# Altium project EFPR-HPTECH_V1.2.PrjPCB
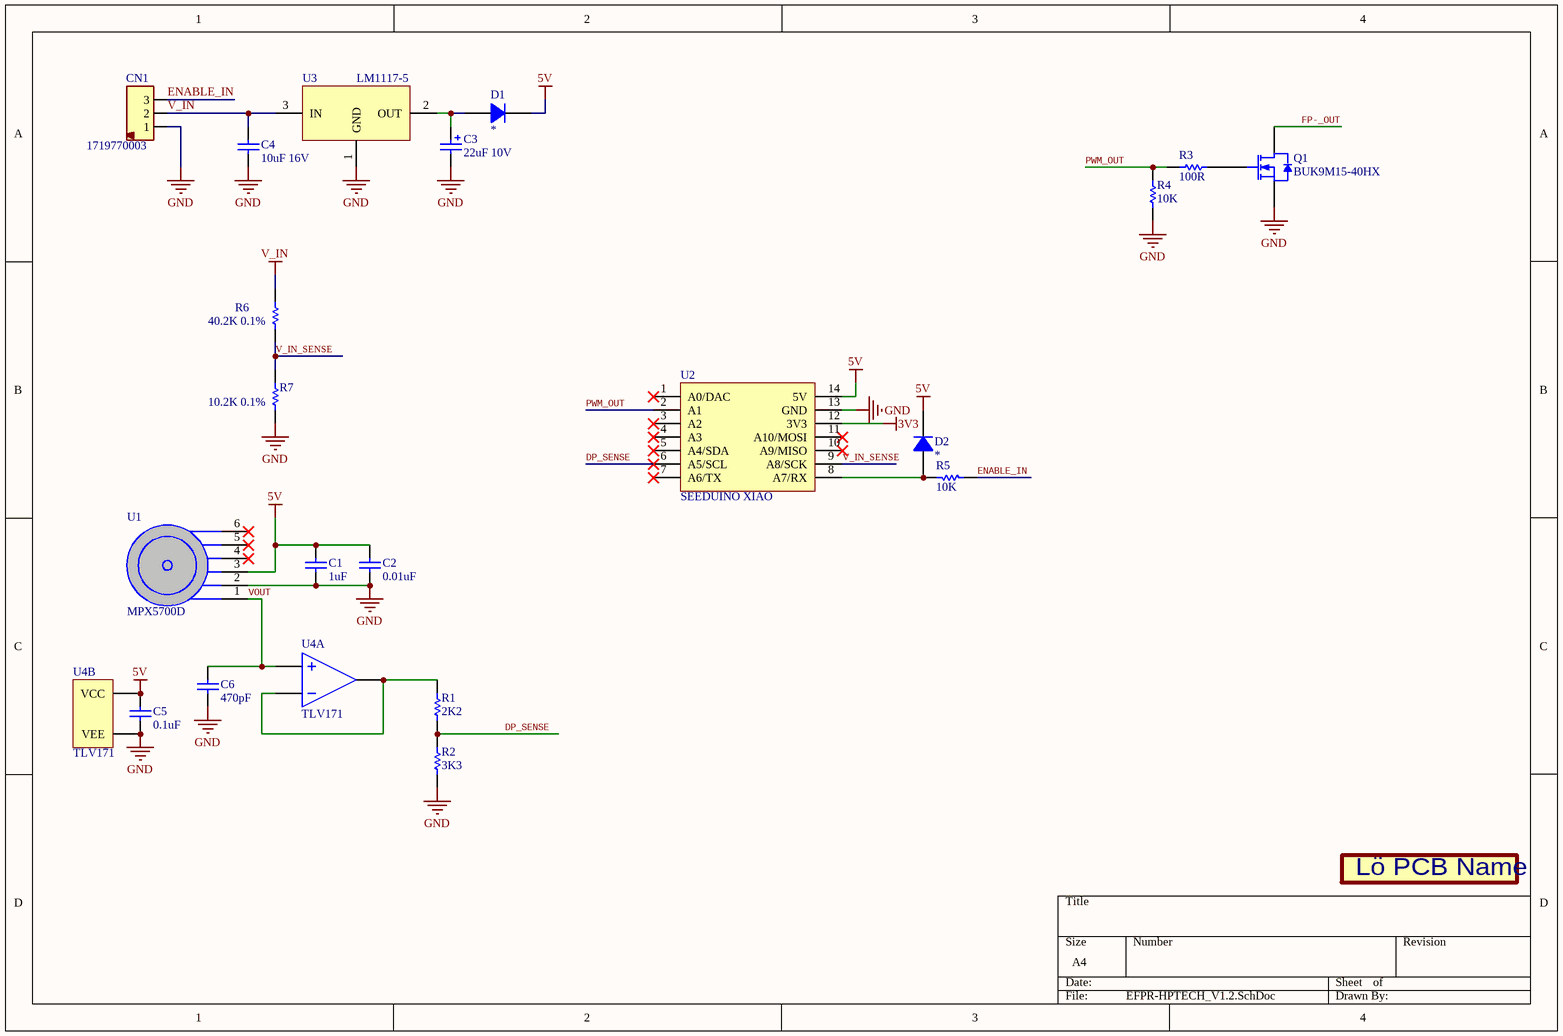
[diagram p0: EFPR-HPTECH_V1.2.SchDoc]
1 sheet, 22 parts. Net scope: global (net labels, ports and power ports of the same name join across sheets).
Board file: EFPR-HPTECH_V1.2.PcbDoc

## Sheet EFPR-HPTECH_V1.2.SchDoc
size A4

### Parts
C1  1uF  [0805S]
C2  0.01uF  [0603s]
C3  22uF 10V  [C1206]
C4  10uF 16V  [C0805NP]
C5  0.1uF  [0603s]
C6  470pF  [0603s]
CN1  1719770003  [1719770003]
D1  *  [SOD323_SC76]
D2  *  [SOD323_SC76]
EFPR-HPT_v1.2  Lo_PCB_Name_15mm  [Logo_Lo_PCB_Name _15mm]  (value not drawn)
Q1  BUK9M15-40HX  [SOT1210]
R1  2K2  [0603s]
R2  3K3  [0603s]
R3  100R  [0603s]
R4  10K  [0603s]
R5  10K  [0603s]
R6  40.2K 0.1%  [0603s]
R7  10.2K 0.1%  [0603s]
U1  MPX5700D  [MPX5700D]
U2  SEEDUINO XIAO  [SEEDUINO_XIAO]
U3  LM1117-5  [SOT223_REG]
U4  TLV171  [SOT23-5]  (parts A,B of 2)

### Nets
3V3: U2.12(3V3)
5V: C1.2 C2.2 C5.2 D1.K D2.K U1.3 U2.14(5V) U4.VCC
GND: C1.1 C2.1 C3.2 C4.1 C5.1 C6.1 CN1.1 Q1.3(S) R2.2 R4.1 R7.1 U1.2 U2.13(GND) U3.1(GND) U4.VEE
V_IN: C4.2 CN1.2 R6.1 U3.3(IN)
DP_SENSE: R1.2 R2.1 U2.6(A5/SCL)
ENABLE_IN: CN1.3 R5.2
FP-_OUT: Q1.2(D)
PWM_OUT: R3.1 R4.2 U2.2(A1)
V_IN_SENSE: R6.2 R7.2 U2.9(A8/SCK)
VOUT: C6.2 U1.1 U4.IP(+IN1)
NetC3_1: C3.1 D1.A U3.2(OUT)
NetD2_A: D2.A R5.1 U2.8(A7/RX)
NetQ1_1: Q1.1(G) R3.2
NetR1_1: R1.1 U4.IM(-IN1) U4.O(OUT1)

Not connected (* = marked no-connect by the designer): U1 4* 5* 6*; U2 1(A0/DAC)* 3(A2)* 4(A3)* 5(A4/SDA)* 7(A6/TX)* 10(A9/MISO)* 11(A10/MOSI)*

### Notes on the sheet
- (in symbol Lö_PCB_Name_15mm) Lö PCB Name

### Library data of the parts
C1 C2 C4-C6 = Cap Semi: Small Capacitor
  C1: VALUE: 1uF
  C2: VALUE: 0.01uF
  C4: VALUE: 10uF 16V
  C5: VALUE: 0.1uF
  C6: VALUE: 470pF
C3 = Cap Pol: Pol. Capacitor; VALUE: 22uF 10V
CN1 = 1719770003: CONN HEADER SMD R/A 3POS 2.54MM; Manufacturer_Name: Molex; DeviceName: Connector 3 Pos; DeviceSetName: CN; LibraryName: QT_Connectors; Manufacturer_Part_Number: 1719770003; Height: 7 mm; DigiKey_Part_Number: WM22677-ND
D1 D2 = DIODE_STD: Standard Diode; Value: *
EFPR-HPT_v1.2 = Lö_PCB_Name_15mm
Q1 = Power N-MOSFET: N-Channel MOSFET; pin to pad: 1>G 2>D 3>S; PartNumber: BUK9M15-40HX
R1-R7 = RES_SMD: Resistor
  R1: Value: 2K2
  R2: Value: 3K3
  R3: Value: 100R
  R4 R5: Value: 10K
  R6: Value: 40.2K 0.1%
  R7: Value: 10.2K 0.1%
U2 = SEEDUIONA_XIAO
U3 = LDO_TAB: Voltage Regulator (LDO); Output in Tab; PartNumber: LM1117-5
U4 = OP_AMP1: Single Operational Amplifier; pin to pad: IM>4 IP>3 O>1 VCC>5 VEE>2; PartNumber: TLV171
U1 = MPX5700D: PartNumber: MPX5700D